# Altium schematic sheet esc.SchDoc
size A4
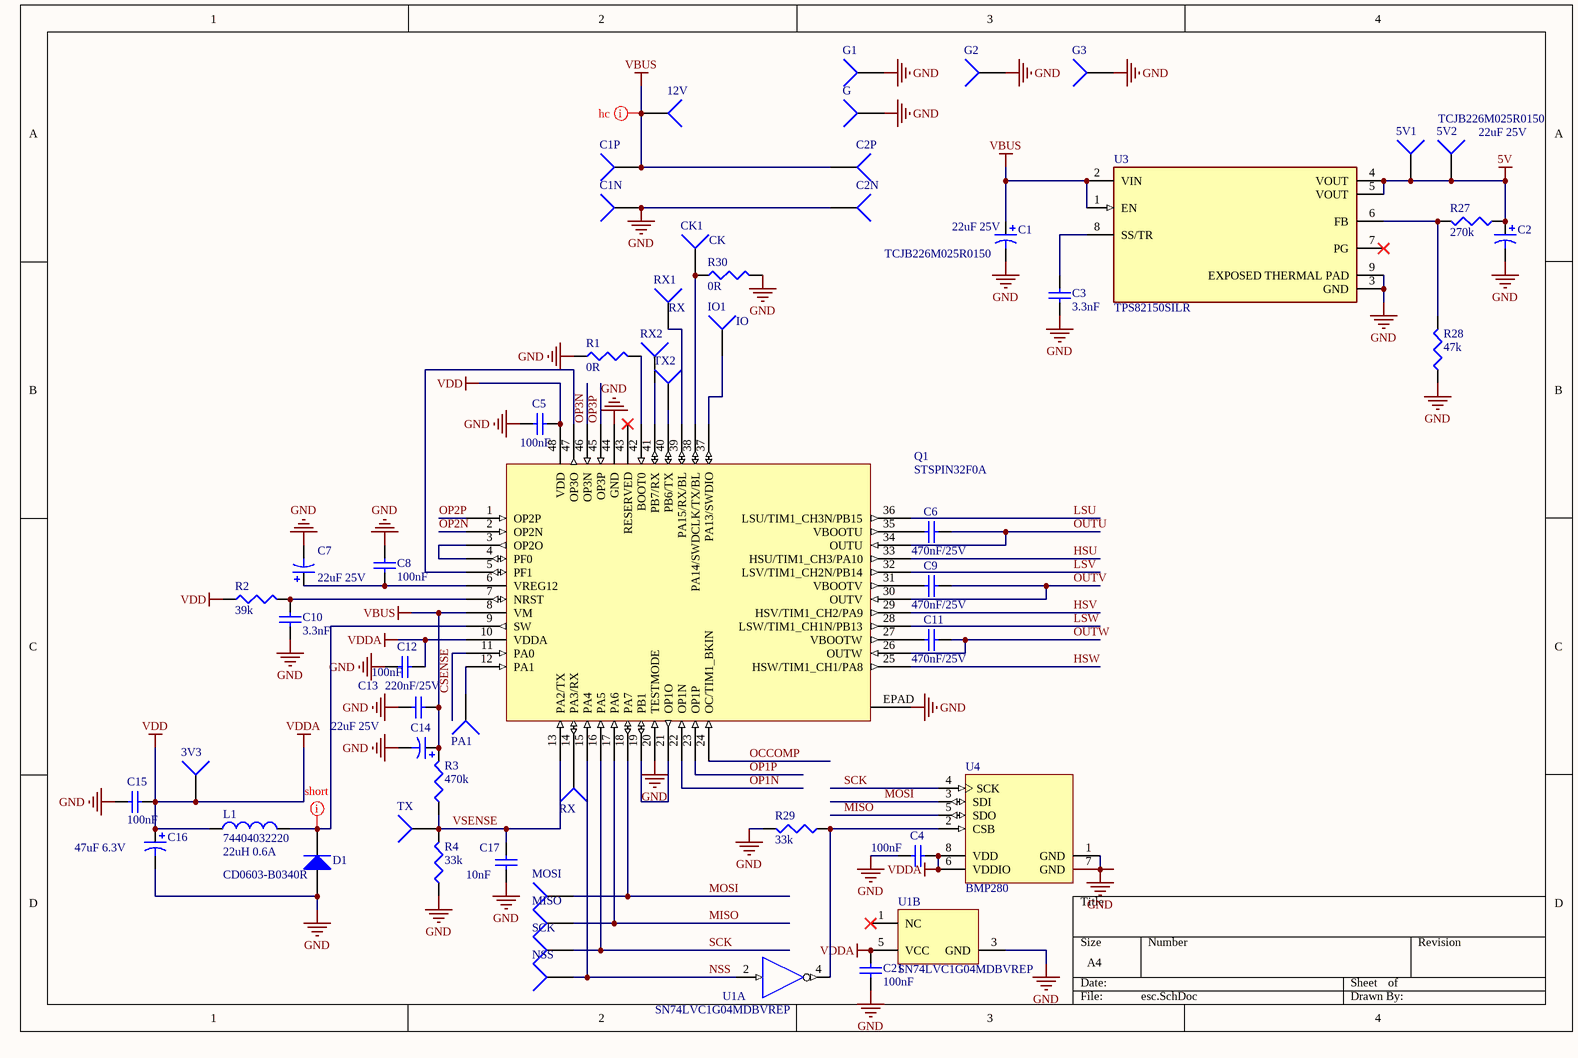
[diagram p0: esc.SchDoc]

## Parts
3V3  3V3  [large_pin]  (value not drawn)
5V1  5V1  [large_pin]  (value not drawn)
5V2  5V2  [large_pin]  (value not drawn)
12V  12V  [large_pin]  (value not drawn)
C1  TCJB226M025R0150  value 22uF 25V  [my_0805_pol]
C1N  C1N  [large_pin]  (value not drawn)
C1P  C1P  [large_pin]  (value not drawn)
C2  TCJB226M025R0150  value 22uF 25V  [my_0805_pol]
C2N  C2N  [large_pin]  (value not drawn)
C2P  C2P  [large_pin]  (value not drawn)
C3  3.3nF  [MY_0402]
C4  100nF  [MY_0402]
C5  100nF  [MY_0402]
C6  470nF/25V  [MY_0402]
C7  value 22uF 25V  [MY_0805_pol]
C8  100nF  [MY_0402]
C9  470nF/25V  [MY_0402]
C10  3.3nF  [MY_0402]
C11  470nF/25V  [MY_0402]
C12  100nF  [MY_0402]
C13  220nF/25V  [MY_0402]
C14  value 22uF 25V  [my_0805_pol]
C15  100nF  [MY_0402]
C16  value 47uF 6.3V  [my_1206_pol]
C17  10nF  [MY_0402]
C21  100nF  [MY_0402]
CK1  CK  [solder_pin_small]
D1  CD0603-B0340R  [my_0603]
G  G  [large_pin]  (value not drawn)
G1  G  [large_pin]  (value not drawn)
G2  G  [large_pin]  (value not drawn)
G3  G  [large_pin]  (value not drawn)
IO1  IO  [solder_pin_small]
L1  74404032220  value 22uH 0.6A  [IND_3_3]
MISO  MISO  [large_pin]  (value not drawn)
MOSI  MOSI  [large_pin]  (value not drawn)
NSS  NSS  [large_pin]  (value not drawn)
PA1  PA1  [large_pin]  (value not drawn)
Q1  STSPIN32F0A  [VFQFPN48]
R1  0R  [MY_0402]
R2  39k  [MY_0402]
R3  470k  [MY_0402]
R4  33k  [MY_0402]
R27  270k  [MY_0402]
R28  47k  [MY_0402]
R29  33k  [MY_0402]
R30  0R  [MY_0402]
RX  RX  [large_pin]  (value not drawn)
RX1  RX  [solder_pin_small]
RX2  PA1  [large_pin]  (value not drawn)
SCK  SCK  [large_pin]  (value not drawn)
TX  RX  [large_pin]  (value not drawn)
TX2  TX2  [large_pin]  (value not drawn)
U1  SN74LVC1G04MDBVREP  [DBV0005A_M]  (parts A,B of 2)
U3  TPS82150SILR  [FP-SIL0008D-MFG]
U4  BMP280  [BOSC-LGA-8_V]

## Nets
5V: 5V1.1 5V2.1 C2.1 R27.1 U3.4(VOUT) U3.5(VOUT)
GND: C1.2 C1N.1 C2.2 C2N.1 C3.1 C4.2 C5.1 C7.2 C8.1 C10.2 C12.2 C13.2 C14.2 C15.1 C16.2 C17.2 C21.2 D1.1(A) G.1 G1.1 G2.1 G3.1 Q1.20(TESTMODE) Q1.44(GND) Q1.EPAD R1.1 R4.1 R28.1 R29.2 R30.2 U1.3(GND) U3.3(GND) U3.9(EXPOSED_THERMAL_PAD) U4.1(GND) U4.7(GND)
VBUS: 12V.1 C1.1 C1P.1 C2P.1 C13.1 C14.1 Q1.8(VM) R3.2 U3.1(EN) U3.2(VIN)
VDD: 3V3.1 C4.1 C5.2 C12.1 C15.2 C16.1 C21.1 L1.1 Q1.10(VDDA) Q1.48(VDD) R2.1 U1.5(VCC) U4.6(VDDIO) U4.8(VDD)  [also labelled VDDA]
CSENSE: Q1.11(PA0)
HSU: Q1.33(HSU/TIM1_CH3/PA10)
HSV: Q1.29(HSV/TIM1_CH2/PA9)
HSW: Q1.25(HSW/TIM1_CH1/PA8)
LSU: Q1.36(LSU/TIM1_CH3N/PB15)
LSV: Q1.32(LSV/TIM1_CH2N/PB14)
LSW: Q1.28(LSW/TIM1_CH1N/PB13)
MISO: MISO.1 Q1.17(PA6) U4.5(SDO)
MOSI: MOSI.1 Q1.18(PA7) U4.3(SDI)
NSS: NSS.1 Q1.15(PA4) U1.2(A)
OCCOMP: Q1.24(OC/TIM1_BKIN)
OP1N: Q1.22(OP1N)
OP1P: Q1.23(OP1P)
OP2N: Q1.2(OP2N)
OP2P: Q1.1(OP2P)
OP3N: Q1.46(OP3N)
OP3P: Q1.45(OP3P)
OUTU: C6.2 Q1.34(OUTU)
OUTV: C9.2 Q1.30(OUTV)
OUTW: C11.2 Q1.26(OUTW)
SCK: Q1.16(PA5) SCK.1 U4.4(SCK)
VSENSE: C17.1 Q1.13(PA2/TX) R3.1 R4.2 TX.1
NetC3_2: C3.2 U3.8(SS/TR)
NetC6_1: C6.1 Q1.35(VBOOTU)
NetC7_1: C7.1 C8.2 Q1.6(VREG12)
NetC9_1: C9.1 Q1.31(VBOOTV)
NetC10_1: C10.1 Q1.7(NRST) R2.2
NetC11_1: C11.1 Q1.27(VBOOTW)
NetCK1_1: CK1.1 Q1.38(PA14/SWDCLK/TX/BL) R30.1
NetD1_2: D1.2(K) L1.2 Q1.9(SW)
NetIO1_1: IO1.1 Q1.37(PA13/SWDIO)
NetPA1_1: PA1.1 Q1.12(PA1)
NetQ1_3: Q1.3(OP2O) Q1.4(PF0)
NetQ1_5: Q1.5(PF1) Q1.47(OP3O)
NetQ1_14: Q1.14(PA3/RX) RX.1
NetQ1_19: Q1.19(PB1) Q1.21(OP1O)
NetQ1_39: Q1.39(PA15/RX/BL) RX1.1
NetQ1_40: Q1.40(PB6/TX) TX2.1
NetQ1_41: Q1.41(PB7/RX) RX2.1
NetQ1_42: Q1.42(BOOT0) R1.2
NetR27_2: R27.2 R28.2 U3.6(FB)
NetR29_1: R29.1 U1.4(Y) U4.2(CSB)

Not connected (* = marked no-connect by the designer): Q1 43(RESERVED)*; U1 1(NC)*; U3 7(PG)*

## Layout directives
net class short: NetD1_2
net class hc: VBUS

## Library data of the parts
3V3 5V1 5V2 12V C1N C1P C2N C2P CK1 G G1-G3 IO1 MISO MOSI NSS PA1 RX RX1 RX2 SCK TX TX2 = Socket: LatestRevisionDate: 17-Jul-2002; LatestRevisionNote: Re-released for DXP Platform.; Publisher: Altium Limited
C1 C2 C7 C14 C16 = Cap Pol3: Polarized Capacitor (Surface Mount); Published: 8-Jun-2000; LatestRevisionDate: 29-May-2009; LatestRevisionNote: IPC-7351 Footprint Added.; PackageReference: C0805; Publisher: Altium Limited; PackageDescription: Chip Capacitor
C3 C17 = Cap: Capacitor; Value: 4.7nF; Published: 8-Jun-2000; LatestRevisionDate: 17-Jul-2002; LatestRevisionNote: Re-released for DXP Platform.; PackageReference: RAD-0.3; Publisher: Altium Limited; PackageDescription: Radial Cap, Thru-Hole; 2 Leads; 0.3 in Pin Spacing
C4 C5 C8 C12 C15 C21 = Cap: Capacitor; Published: 8-Jun-2000; LatestRevisionDate: 17-Jul-2002; LatestRevisionNote: Re-released for DXP Platform.; PackageReference: RAD-0.3; Publisher: Altium Limited; PackageDescription: Radial Cap, Thru-Hole; 2 Leads; 0.3 in Pin Spacing; Value: 100nF
C6 C9 C11 = Cap: Capacitor; Value: 470nF; Published: 8-Jun-2000; LatestRevisionDate: 17-Jul-2002; LatestRevisionNote: Re-released for DXP Platform.; PackageReference: RAD-0.3; Publisher: Altium Limited; PackageDescription: Radial Cap, Thru-Hole; 2 Leads; 0.3 in Pin Spacing
C10 C13 = Cap: Capacitor; Value: 100nF; Published: 8-Jun-2000; LatestRevisionDate: 17-Jul-2002; LatestRevisionNote: Re-released for DXP Platform.; PackageReference: RAD-0.3; Publisher: Altium Limited; PackageDescription: Radial Cap, Thru-Hole; 2 Leads; 0.3 in Pin Spacing
D1 = Diode: Default Diode; Published: 8-Jun-2000; LatestRevisionDate: 17-Jul-2002; LatestRevisionNote: Re-released for DXP Platform.; PackageVersion: Sep-1996; PackageReference: SMC; Publisher: Altium Limited; PackageDescription: DO-214-AB/SMC; 2 C-Bend Leads; Body 7.9 x 5.9 mm, inc. leads (LxW); Code_JEDEC: DO-214-AB
L1 = Inductor: Code_IEC: 1005; Published: 8-Jun-2000; LatestRevisionDate: 29-May-2009; LatestRevisionNote: IPC-7351 Footprint Added.; PackageReference: 0402-A; Publisher: Altium Limited; PackageDescription: Chip Inductor; Code_JEITA: 0402
R1-R4 R27-R30 = Res3: Resistor; Value: 10K; Published: 8-Jun-2000; LatestRevisionDate: 29-May-2009; LatestRevisionNote: IPC-7351 Footprint Added.; PackageReference: J1-0603; Publisher: Altium Limited; PackageDescription: Chip Resistor
U1 = CMP-0859-00138-3: Enhanced Product Single Inverter Gate, DBV0005A, LARGE T&R; Manufacturer: Texas Instruments; Generic Part Number: SN74LVC1G04-EP; Bits(#): 1; Input Type: CMOS/TTL; Logic: Inverting; Schmitt Trigger: No; Output Drive (IOL/IOH)(Max)(mA): 32/-32; tpd @ Nom Voltage(Max)(ns): 13.9,8,5.7,4.5; Rating: HiRel Enhanced Product; Output Type: CMOS; Technology Family: LVC; Sub-Family: Inverting Buffer/Driver; ICC @ Nom Voltage(Max)(mA): 0.01; VCC(Min)(V): 1.65; VCC(Max)(V): 5.5; F @ Nom Voltage(Max)(Mhz): 150; Voltage(Nom)(V): 1.8,2.5,3.3,5; DatasheetVersion: SCES691A; 3-State Output: No; PackageReference: DBV0005A; Operating Temperature Range(C): -55 to 125
U3 = CMP-04918-000050-1: DC DC CONVERTER 0.9-6V; Manufacturer: Texas Instruments; Max Junction Temp: +110°C; Number Of Outputs: 1; Max Supply Voltage: 17V; Max Duty Cycle: 100%; Output Type: AdjustableProgrammable; Switching Frequency: 2MHz; Output Current: 1A; Switching Topology: Buck; Min Supply Voltage: 3V; Nominal Supply Current: 20uA; RoHS: TRUE; Category: IC; Output Voltage: 0.9-6V; Temperature Range Low: -40°C; Device Class L1: Integrated Circuits (ICs); Automotive: No; ComponentLink2URL: http://www.ti.com/lit/ds/symlink/tps82150.pdf; Package: SIL0008D; Manufacturer Part Number: TPS82150SILR; Temperature: -40°C to +125°C; Device Class L2: Power Management ICs; Lead Free: Yes; ComponentLink2Description: Datasheet; Device Class L3: Voltage Regulators - Switching; Octopart: https://octopart.com/tps82150silr-texas+instruments-83003514; Temperature Range High: +125°C; Height: 1.53mm; Digikey Description: DC DC CONVERTER 0.9-6V
U4 = CMP-2000-05076-1: Digital Pressure Sensor, 1.71 to 3.6 V, -40 to 85 degC, 8-Pin LGA, RoHS, Tape and Reel; Manufacturer: Bosch Sensortec; Manufacturer URL: http://www.bosch-sensortec.com; Datasheet URL: http://datasheet.octopart.com/BMP280-Bosch-datasheet-41546027.pdf; Datasheet Version: Rev. 1.14, 05/2015